# Altium schematic sheet Nano.SchDoc
size 292 x 193 mm
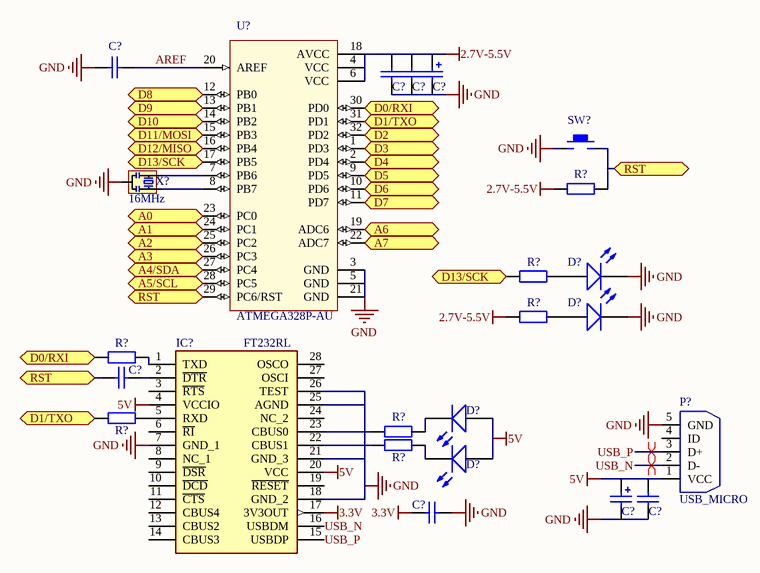
[diagram p0: Nano.SchDoc]

## Parts
(Parts that share a designator on the sheet are numbered #1, #2 ... from top to bottom, then left to right.)
C?#1  4.7uF 16V  [CAP-AUX-3216]  (value not drawn)
C?#2  100nF  [CAP-0603]  (value not drawn)
C?#3  1uF  [CAP-0603]  (value not drawn)
C?#4  1uF  [CAP-0603]  (value not drawn)
C?#5  100nF  [CAP-0603]  (value not drawn)
C?#6  4.7uF 16V  [CAP-AUX-3216]  (value not drawn)
C?#7  100nF  [CAP-0603]  (value not drawn)
C?#8  100nF  [CAP-0603]  (value not drawn)
D?#1  GREEN  [LED-0603]  (value not drawn)
D?#2  RED  [LED-0603]  (value not drawn)
D?#3  RED  [LED_0603]  (value not drawn)
D?#4  GREEN  [LED_0603]  (value not drawn)
IC?  FT232RL  [SSOP]
P?  USB_MICRO  [Micro usb座 -全贴片]
R?#1  1K  [R-0603]  (value not drawn)
R?#2  330R  [R-0603]  (value not drawn)
R?#3  10K  [R-0603]  (value not drawn)
R?#4  1K  [R-0603]  (value not drawn)
R?#5  1K  [R-0603]  (value not drawn)
R?#6  1K  [R-0603]  (value not drawn)
R?#7  1K  [R-0603]  (value not drawn)
SW?  KEY  [KEY-4P-4.2*3.4*2.5]  (value not drawn)
U?  ATMEGA328P-AU  [*QFP80P900X900X120-32N]
X?  16MHz  [CSTCE_G(A)村田晶振]

## Ports
A0 (bidir), A1 (bidir), A2 (bidir), A3 (bidir), A4/SDA (bidir), A5/SCL (bidir), A6 (bidir), A7 (bidir), D0/RXI (bidir), D1/TXO (bidir), D2 (bidir), D3 (bidir), D4 (bidir), D5 (bidir), D6 (bidir), D7 (bidir), D8 (bidir), D9 (bidir), D10 (bidir), D11/MOSI (bidir), D12/MISO (bidir), D13/SCK (bidir), RST (bidir)

## Nets
2.7V-5.5V: C?#1.1 C?#3.2 C?#4.2 R?#1.1 R?#3.1 U?.4(VCC) U?.6(VCC) U?.18(AVCC)
3.3V: C?#7.2 IC?.17(3V3OUT)
5V: C?#6.1 C?#8.2 D?#3.A D?#4.A IC?.4(VCCIO) IC?.20(VCC) P?.1(VCC)
GND: C?#1.2 C?#2.1 C?#3.1 C?#4.1 C?#6.2 C?#7.1 C?#8.1 D?#1.K D?#2.K IC?.7(GND_1) IC?.18(GND_2) IC?.21(GND_3) IC?.25(AGND) IC?.26(TEST) P?.5(GND) SW?.1 U?.3(GND) U?.5(GND) U?.21(GND) X?.2(GND)
A0: U?.23(PC0) ; port A0
A1: U?.24(PC1) ; port A1
A2: U?.25(PC2) ; port A2
A3: U?.26(PC3) ; port A3
A4/SDA: U?.27(PC4) ; port A4/SDA
A5/SCL: U?.28(PC5) ; port A5/SCL
A6: U?.19(ADC6) ; port A6
A7: U?.22(ADC7) ; port A7
AREF: C?#2.2 U?.20(AREF)
D0/RXI: R?#4.1 U?.30(PD0) ; port D0/RXI
D1/TXO: R?#5.1 U?.31(PD1) ; port D1/TXO
D2: U?.32(PD2) ; port D2
D3: U?.1(PD3) ; port D3
D4: U?.2(PD4) ; port D4
D5: U?.9(PD5) ; port D5
D6: U?.10(PD6) ; port D6
D7: U?.11(PD7) ; port D7
D8: U?.12(PB0) ; port D8
D9: U?.13(PB1) ; port D9
D10: U?.14(PB2) ; port D10
D11/MOSI: U?.15(PB3) ; port D11/MOSI
D12/MISO: U?.16(PB4) ; port D12/MISO
D13/SCK: R?#2.1 U?.17(PB5) ; port D13/SCK
RST: C?#5.2 R?#1.2 SW?.2 U?.29(PC6/RST) ; port RST
USB_N: IC?.16(USBDM) P?.2(D-)
USB_P: IC?.15(USBDP) P?.3(D+)
NetC?#5_1: C?#5.1 IC?.2(~{DTR})
NetD?#1_A: D?#1.A R?#2.2
NetD?#2_A: D?#2.A R?#3.2
NetD?#3_K: D?#3.K R?#6.2
NetD?#4_K: D?#4.K R?#7.2
NetIC?_1: IC?.1(TXD) R?#4.2
NetIC?_5: IC?.5(RXD) R?#5.2
NetIC?_22: IC?.22(CBUS1) R?#7.1
NetIC?_23: IC?.23(CBUS0) R?#6.1
NetU?_7: U?.7(PB6) X?.1(OSC1)
NetU?_8: U?.8(PB7) X?.3(OSC2)

Not connected (* = marked no-connect by the designer): IC? 3(~{RTS}) 6(~{RI}) 8(NC_1) 9(~{DSR}) 10(~{DCD}) 11(~{CTS}) 12(CBUS4) 13(CBUS2) 14(CBUS3) 19(~{RESET}) 24(NC_2) 27(OSCI) 28(OSCO); P? 4(ID)

## Layout directives
differential pair: USB_N, USB_P

## Library data of the parts
C?#1 C?#6 = CAP-POL: 贴片电容-有极性; ComponentLink1Description: 供应商链接; ComponentLink1URL: http://www.szlcsc.com/product/details_16815.html; Package: 3528; Supplier: LC; SuppliersPartNumber: C16133
C?#2-C?#5 C?#7 C?#8 = CAP: 贴片电容; ComponentLink1Description: 供应商链接; ComponentLink1URL: http://www.szlcsc.com/product/details_53938.html; Package: 0402; Supplier: LC; SuppliersPartNumber: C52923
D?#1-D?#4 = LED: 发光二极管; ComponentLink1Description: 供应商链接; ComponentLink1URL: http://www.szlcsc.com/product/details_2663.html; Package: 0603; Supplier: LC; SuppliersPartNumber: C2290
IC? = FT232RL: USB to UART; Manufacturer_Name: FTDI Chip; Datasheet Link: http://www.ftdichip.com/Support/Documents/DataSheets/ICs/DS_FT232R.pdf; Height: 2mm; Manufacturer_Part_Number: FT232RL; RS Part Number: 0406580P; RS Price/Stock: http://uk.rs-online.com/web/p/products/0406580P
P? = USB_MICRO: USB 接口
R?#1-R?#7 = RES: 贴片电阻; Package: 0805; Supplier: LC; SuppliersPartNumber: C17798
SW? = KEY: 按键开关
U? = ATMEGA328P-AU: 微控制器, 8 Bit, Atmega, 20mhz, Tqfp-32; MF: Microchip; SnapEDA_Link: https://www.snapeda.com/parts/ATMEGA328P-AU/Microchip/view-part/?ref=snap; Availability: Unavailable; Price: None; MP: ATMEGA328P-AU; Package: TQFP-32 Microchip; Value: *
X? = XTAL: 有源晶振